# EAGLE design toastershield (EAGLE 7.5.0)
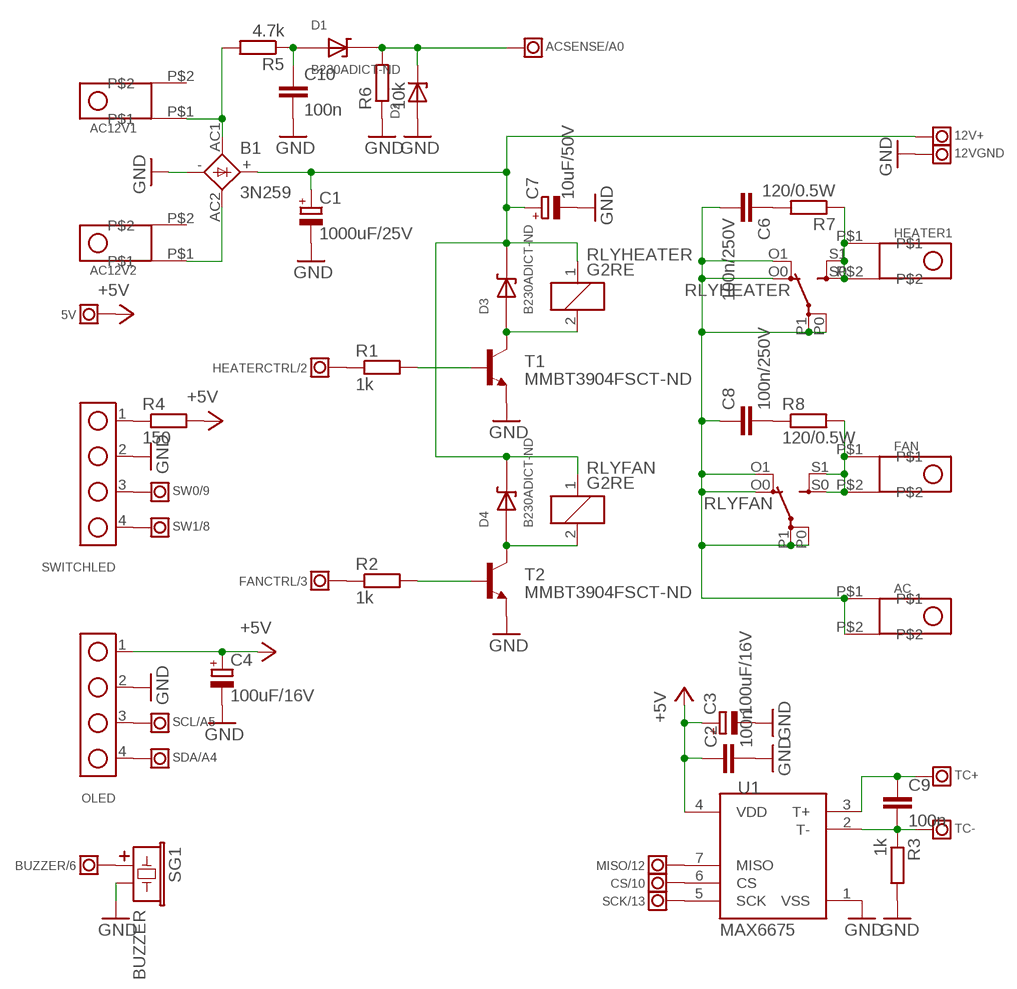
[diagram p0: schematic, sheet 1]

## Parts
5V  PIN-HEADER  [PIN-HEADER-MALE]
12V+  PIN-HEADER  [PIN-HEADER-MALE]
12VGND  PIN-HEADER  [PIN-HEADER-MALE]
AC  QUICKCONNECT-TAB  [QUICKCONNECT-TAB-6.35X0.81]
AC12V1  QUICKCONNECT-TAB  [QUICKCONNECT-TAB-6.35X0.81]
AC12V2  QUICKCONNECT-TAB  [QUICKCONNECT-TAB-6.35X0.81]
ACSENSE/A0  PIN-HEADER  [PIN-HEADER-MALE]
B1  3N259  [KBPM]
BUZZER/6  PIN-HEADER  [PIN-HEADER-MALE]
C1  1000uF/25V  CPOL-EUE5-13  [E5-13]
C2  100n  C-EUC0603  [C0603]
C3  100uF/16V  CPOL-EUE2.5-7  [E2,5-7]
C4  100uF/16V  CPOL-EUE2.5-7  [E2,5-7]
C6  100n/250V  C-EUC1210  [C1210]
C7  10uF/50V  CPOL-EUE2.5-5  [E2,5-5]
C8  100n/250V  C-EUC1210  [C1210]
C9  100n  C-EUC0603  [C0603]
C10  100n  C-EUC0603  [C0603]
CS/10  PIN-HEADER  [PIN-HEADER-MALE]
D1  B230ADICT-ND  [SMA/SMB]
D2  MA8051CT  [SOD323-W]
D3  B230ADICT-ND  [SMA/SMB]
D4  B230ADICT-ND  [SMA/SMB]
FAN  QUICKCONNECT-TAB  [QUICKCONNECT-TAB-6.35X0.81]
FANCTRL/3  PIN-HEADER  [PIN-HEADER-MALE]
HEATER1  QUICKCONNECT-TAB  [QUICKCONNECT-TAB-6.35X0.81]
HEATERCTRL/2  PIN-HEADER  [PIN-HEADER-MALE]
MISO/12  PIN-HEADER  [PIN-HEADER-MALE]
OLED  4-PIN-WAFER-CONN  [WAFER_MALE_4PIN]
R1  1k  R-EU_R0603  [R0603]
R2  1k  R-EU_R0603  [R0603]
R3  1k  R-EU_R0603  [R0603]
R4  150  R-EU_R0603  [R0603]
R5  4.7k  R-EU_R0603  [R0603]
R6  10k  R-EU_R0603  [R0603]
R7  120/0.5W  R-EU_R1210  [R1210]
R8  120/0.5W  R-EU_R1210  [R1210]
RLYFAN  G2RE  [G2RE]
RLYHEATER  G2RE  [G2RE]
SCK/13  PIN-HEADER  [PIN-HEADER-MALE]
SCL/A5  PIN-HEADER  [PIN-HEADER-MALE]
SDA/A4  PIN-HEADER  [PIN-HEADER-MALE]
SG1  BUZZER  [BUZZER-12X7.5]
SW0/9  PIN-HEADER  [PIN-HEADER-MALE]
SW1/8  PIN-HEADER  [PIN-HEADER-MALE]
SWITCHLED  4-PIN-WAFER-CONN  [WAFER_MALE_4PIN]
T1  MMBT3904FSCT-ND  [SOT-23]
T2  MMBT3904FSCT-ND  [SOT-23]
TC+  PIN-HEADER  [PIN-HEADER-MALE]
TC-  PIN-HEADER  [PIN-HEADER-MALE]
U1  MAX6675  [SO08-MAX6675]

## Nets
12VDC: 12V+.P$1 B1.+ C1.+ C7.+ D3.1(CAT) D4.1(CAT) RLYFAN.1 RLYHEATER.1
+5V: 5V.P$1 C2.1 C3.+ C4.+ OLED.1 R4.2 U1.4(VDD)
AC: AC.P$1 AC.P$2 C6.2 C8.1 RLYFAN.O0(2:O) RLYFAN.O1(2:O) RLYFAN.P0(2:P) RLYFAN.P1(2:P) RLYHEATER.O0(2:O) RLYHEATER.O1(2:O) RLYHEATER.P0(2:P) RLYHEATER.P1(2:P)
AC12V0: AC12V1.P$1 B1.AC1 R5.2
AC12V1: AC12V2.P$1 B1.AC2
BUZZER: BUZZER/6.P$1 SG1.+
FAN: FAN.P$1 FAN.P$2 R8.2 RLYFAN.S0(2:S) RLYFAN.S1(2:S)
GND: 12VGND.P$1 B1.- C1.- C2.2 C3.- C4.- C7.- C10.2 D2.A(AN) OLED.2 R3.2 R6.1 SG1.- SWITCHLED.2 T1.2(E) T2.2(E) U1.1(VSS)
HEATER: HEATER1.P$1 HEATER1.P$2 R7.1 RLYHEATER.S0(2:S) RLYHEATER.S1(2:S)
LED+: R4.1 SWITCHLED.1
N$1: C9.1 TC+.P$1 U1.3(T+)
N$2: FANCTRL/3.P$1 R2.1
N$4: HEATERCTRL/2.P$1 R1.1
N$5: D3.2(AN) RLYHEATER.2 T1.3(C)
N$6: D4.2(AN) RLYFAN.2 T2.3(C)
N$8: R1.2 T1.1(B)
N$9: R2.2 T2.1(B)
N$10: MISO/12.P$1 U1.7(MISO)
N$13: C9.2 R3.1 TC-.P$1 U1.2(T-)
N$14: CS/10.P$1 U1.6(CS)
N$16: SCK/13.P$1 U1.5(SCK)
N$17: SW0/9.P$1 SWITCHLED.3
N$18: SW1/8.P$1 SWITCHLED.4
N$19: OLED.3 SCL/A5.P$1
N$20: OLED.4 SDA/A4.P$1
N$22: C10.1 D1.2(AN) R5.1
N$23: ACSENSE/A0.P$1 D1.1(CAT) D2.C(CAT) R6.2
N$24: C8.2 R8.1
N$26: C6.1 R7.2
Unconnected: AC12V1.P$2 AC12V2.P$2

## Library data of the parts
5V 12V+ 12VGND ACSENSE/A0 BUZZER/6 CS/10 FANCTRL/3 HEATERCTRL/2 MISO/12 SCK/13 SCL/A5 SDA/A4 SW0/9 SW1/8 TC+ TC- = mrrcomps:PIN-HEADER
AC AC12V1 AC12V2 FAN HEATER1 = Wafer-Connectors:QUICKCONNECT-TAB
B1 = BAV70:3N259
C1 C3 C4 C7 = rcl:CPOL-EU: POLARIZED CAPACITOR, European symbol
C2 C6 C8-C10 = rcl:C-EU: CAPACITOR, European symbol
D1 D3 D4 = mrrcomps:B230ADICT-ND
D2 = mrrcomps:MA8051CT
OLED SWITCHLED = Wafer-Connectors:4-PIN-WAFER-CONN
R1-R8 = rcl:R-EU_: RESISTOR, European symbol
RLYFAN RLYHEATER = relay:G2RE: RELAY 1 x switch, high current, Omron
SG1 = SparkFun-Electromechanical:BUZZER: Buzzer 12mm Spark Fun Electronics SKU : Comp-Buzzer
T1 T2 = GuShH:MMBT3904
U1 = SparkFun-AnalogIC:MAX6675: K-type thermocouple ADC, SPI output

## Net classes
0 default: width 0.203 mm, drill 0.559 mm, clearance 0.203 mm
2 gnd: width 0.203 mm, drill 0.559 mm, clearance 0.203 mm

## Board
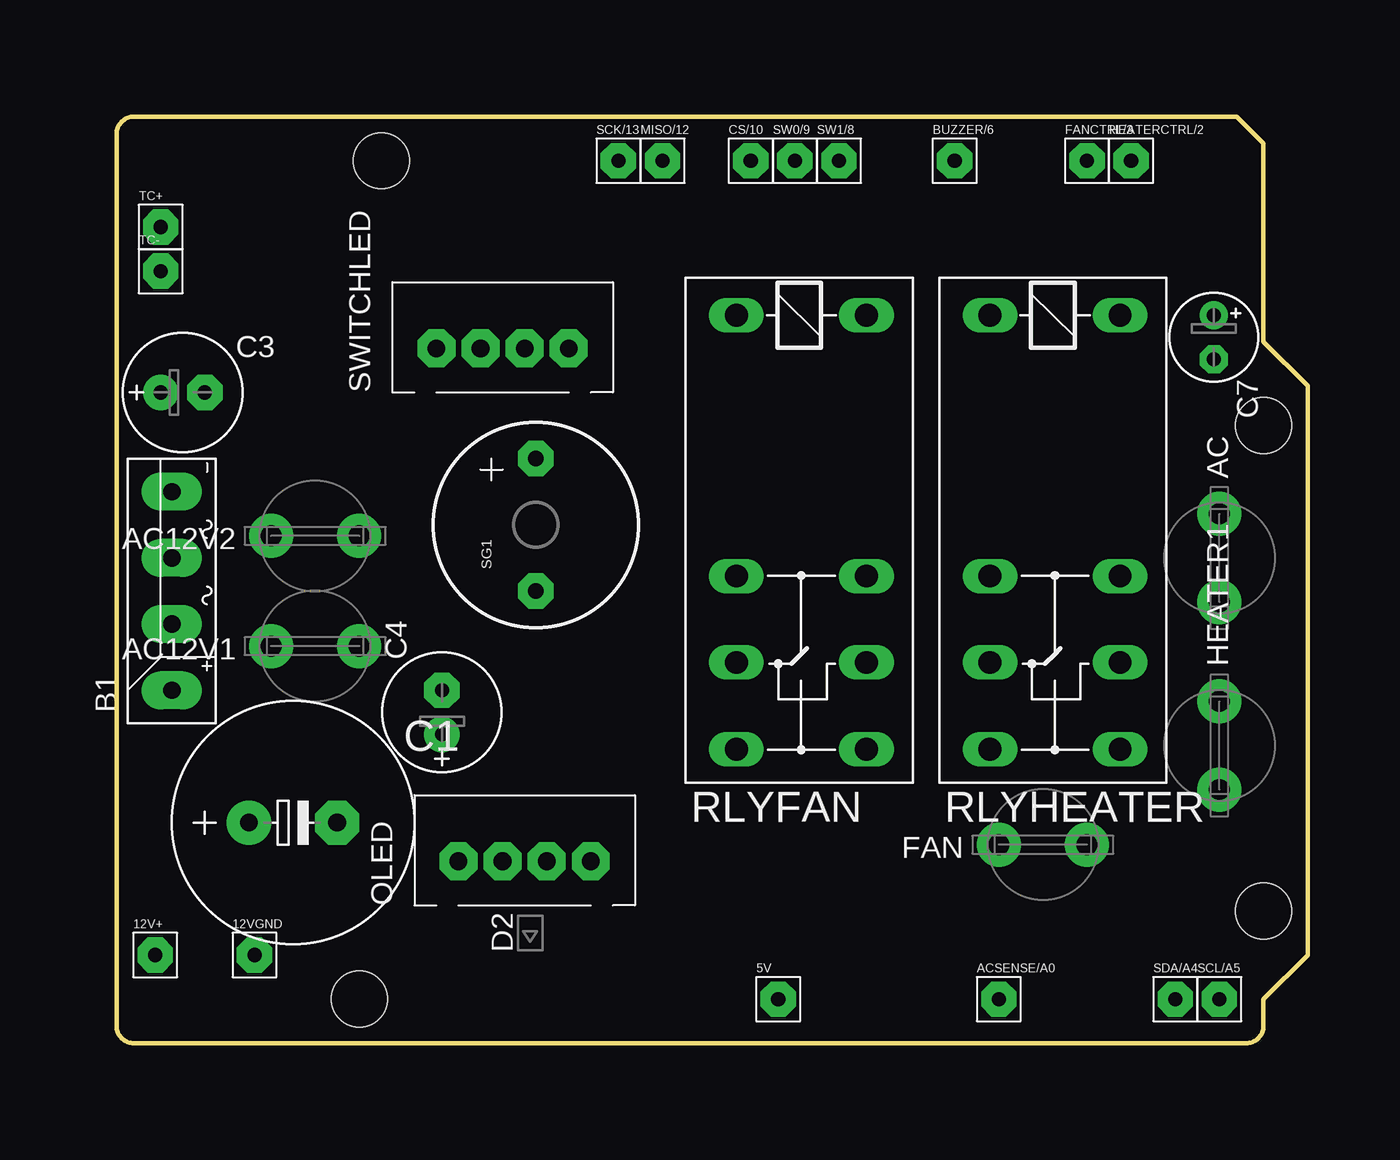
[diagram p1: board, top side]
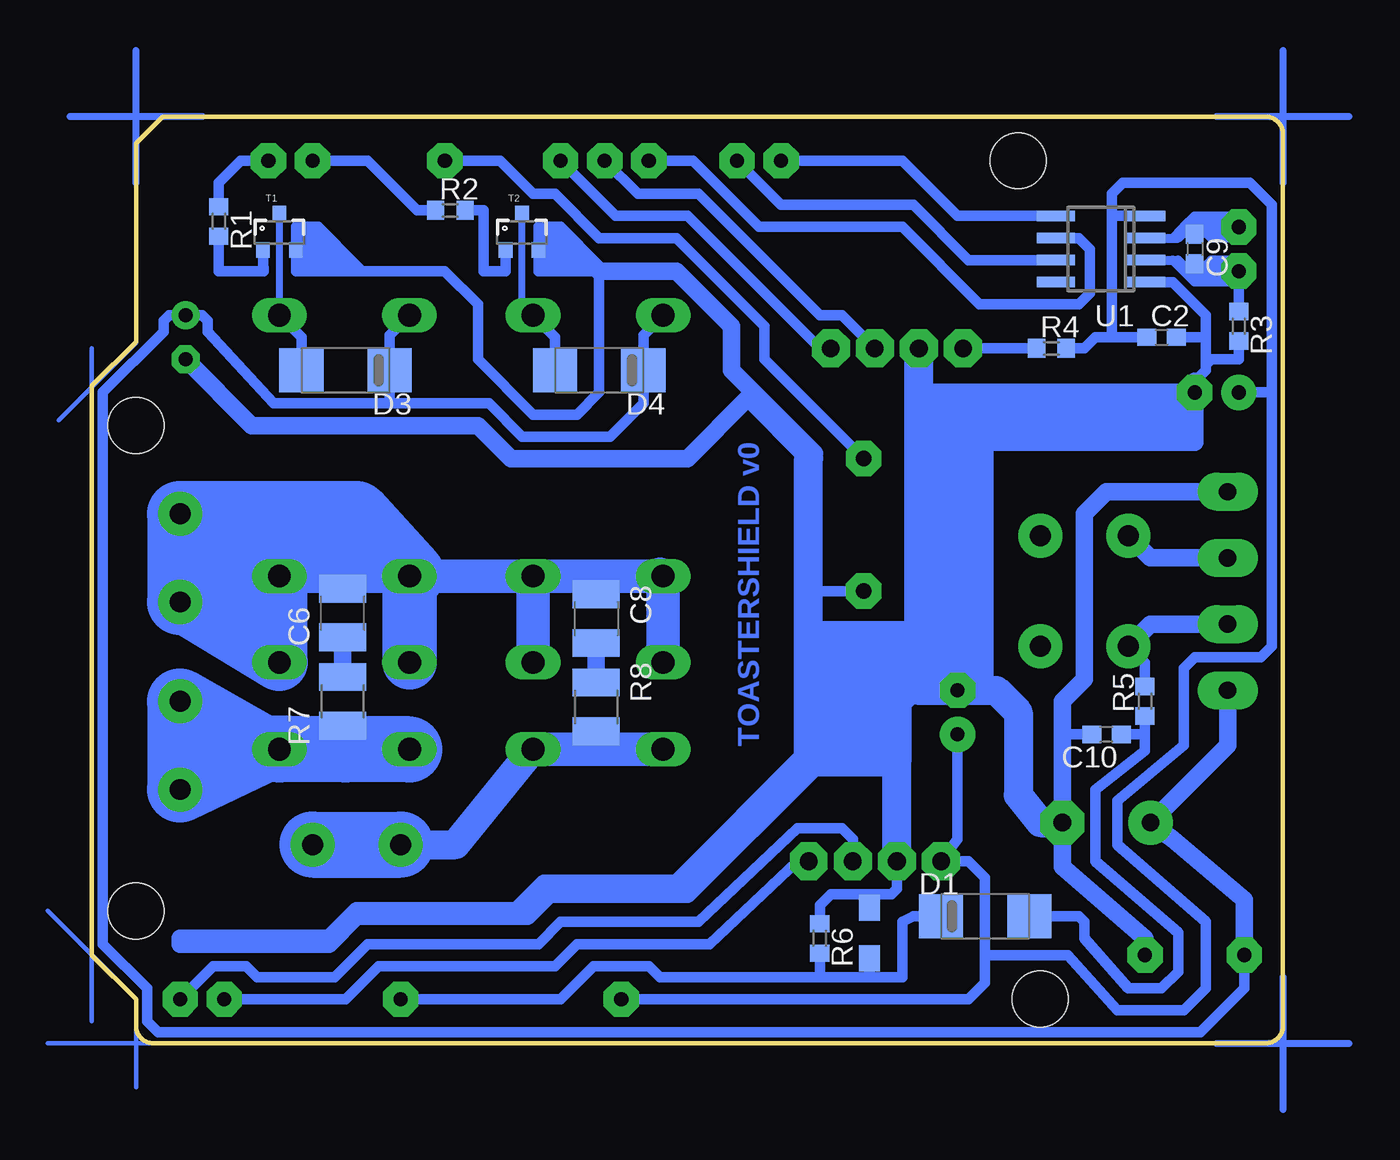
[diagram p2: board, bottom side, seen from below]

Size 68.58 x 53.34 mm. Coordinates in mm from the lower left corner, seen from the top.
Outline: 64.52,53.34 66.04,51.82 66.04,40.39 68.58,37.85 68.58,5.08 66.04,2.54 66.04,1 arc-90 65.04,0 1,0 arc-90 0,1 0,52.34 arc-90 1,53.34 64.52,53.34
Copper layers (1*16): Top 0.035mm / dielectric 1.5mm / Bottom 0.035mm
Design rules "ArduinoUno *": minimum track width 12mil, minimum drill 32mil, track to track 12mil, track to pad 12mil, pad to pad 12mil, via to via 12mil, smd to smd 12mil, copper to edge 32mil, drill to drill 16mil, minimum pad ring 10mil, minimum via ring 10mil, stop-mask expansion 2mil, vias tented up to drill 30mil, thermal gap 10mil
Holes 3.2 mm at 15.24,50.8 66.04,7.62 66.04,35.56 13.97,2.54

### Footprints (pad centres in the part's own frame; a part is rotated, then mirrored left to right if it is on the bottom)
PIN-HEADER-MALE = drill 0.813 pad 2.032 octagon: P$1 0,0
QUICKCONNECT-TAB-6.35X0.81 = drill 1.2 pad 2.54: P$1 2.54,0; P$2 -2.54,0
KBPM = drill 1 pad 2.184 long: + -5.715,0; - 5.715,0; AC1 -1.905,0; AC2 1.905,0
E5-13 = drill 1.016 pad 2.54: + -2.54,0 | drill 1.016 pad 2.54 octagon: - 2.54,0
C0603 = smd 1.1 x 1: 1 -0.85,0; 2 0.85,0
E2,5-7 = drill 0.813 pad 2.032: + -1.27,0 | drill 0.813 pad 2.032 octagon: - 1.27,0
C1210 = smd 1.6 x 2.7: 1 -1.4,0; 2 1.4,0
E2,5-5 = drill 0.813 pad 1.6: + -1.27,0 | drill 0.813 pad 1.6 octagon: - 1.27,0
SMA/SMB = smd 2.54 x 2.54: 1 -2.54,0; 2 2.54,0
SOD323-W = smd 1.5 x 1.2 bottom: A 1.45,0; C -1.45,0
WAFER_MALE_4PIN = drill 1.016 pad 2.184 octagon: 1 -3.81,0; 2 -1.27,0; 3 1.27,0; 4 3.81,0
R0603 = smd 1 x 1.1: 1 -0.85,0; 2 0.85,0
R1210 = smd 1.6 x 2.7: 1 -1.4,0; 2 1.4,0
G2RE = drill 1.321 long: 1 -2.54,-3.683; 2 -2.54,3.81; O0 12.471,-3.683; O1 12.471,3.81; P0 17.45,-3.683; P1 17.45,3.81; S0 22.454,-3.683; S1 22.454,3.81
BUZZER-12X7.5 = drill 0.9 pad 2.032 octagon: + 3.81,0; - -3.81,0
SOT-23 = smd 0.8 x 0.9: 1 -0.95,-1; 2 0.95,-1; 3 0,1.1
SO08-MAX6675 = smd 0.6 x 2.2: 1 -1.905,-2.6; 2 -0.635,-2.6; 3 0.635,-2.6; 4 1.905,-2.6; 5 1.905,2.6; 6 0.635,2.6; 7 -0.635,2.6; 8 -1.905,2.6

### Placement (x,y rotation side)
5V  38.1,2.54 0 top
12V+  2.22,5.08 0 top
12VGND  7.94,5.08 0 top
AC  63.5,27.94 90 top
AC12V1  11.43,22.86 180 top
AC12V2  11.43,29.21 180 top
ACSENSE/A0  50.8,2.54 0 top
B1  3.17,26.04 90 top
BUZZER/6  48.26,50.8 0 top
C1  10.16,12.7 0 top
C2  6.99,40.64 0 bottom
C3  3.81,37.47 0 top
C4  18.73,19.05 90 top
C6  54.15,24.77 90 bottom
C7  63.18,40.64 270 top
C8  39.54,24.45 270 bottom
C9  5.08,45.72 270 bottom
C10  10.16,17.78 180 bottom
CS/10  36.51,50.8 0 top
D1  17.14,7.3 0 bottom
D2  23.81,6.35 90 top
D3  53.98,38.73 180 bottom
D4  39.37,38.73 180 bottom
FAN  53.34,11.43 180 top
FANCTRL/3  55.88,50.8 0 top
HEATER1  63.5,17.14 90 top
HEATERCTRL/2  58.42,50.8 0 top
MISO/12  31.43,50.8 0 top
OLED  23.5,10.48 0 top
R1  61.28,47.31 270 bottom
R2  47.94,47.94 0 bottom
R3  2.54,41.27 270 bottom
R4  13.34,40.01 0 bottom
R5  7.94,19.68 90 bottom
R6  26.67,6.03 270 bottom
R7  54.15,19.68 90 bottom
R8  39.54,19.37 270 bottom
RLYFAN  39.37,39.37 270 top
RLYHEATER  53.98,39.37 270 top
SCK/13  28.89,50.8 0 top
SCL/A5  63.5,2.54 0 top
SDA/A4  60.96,2.54 0 top
SG1  24.13,29.84 90 top
SW0/9  39.05,50.8 0 top
SW1/8  41.59,50.8 0 top
SWITCHLED  22.23,40.01 0 top
T1  57.78,46.67 0 bottom
T2  43.81,46.67 0 bottom
TC+  2.54,46.99 0 top
TC-  2.54,44.45 0 top
U1  10.48,45.72 90 bottom

### Tracks (layer width: path | path; a pad name or v marks a point on that pad's centre or on a via)
12VDC
  Bottom 0.61: 12V+.P$1 2.22,3.17 4.76,0.64 64.77,0.64 65.41,1.27 65.41,3.17 67.94,5.71 67.94,37.47 64.45,40.96 64.45,41.59 64.14,41.91 C7.+ 62.23,41.91 61.91,41.59 61.91,40.96 58.1,36.83 51.44,36.83 | 51.44,36.83 45.72,36.83 43.81,34.92 38.73,34.92 36.83,36.83 D4.1 36.83,40.77 RLYFAN.1 | 51.44,36.83 D3.1 51.44,40.77 RLYHEATER.1
  Bottom 1.016: 12V+.P$1 2.22,8.26 6.35,11.75 C1.+ 3.17,17.14 B1.+
+5V
  Bottom 0.61: 9.84,47.62 9.84,48.9 9.21,49.53 1.91,49.53 0.64,48.26 0.64,37.47 | 5V.P$1 18.1,2.54 17.14,3.49 17.14,5.08 | 0.64,37.47 0.64,22.86 1.27,22.23 5.08,22.23 5.71,21.59 5.71,17.14 9.53,13.97 9.53,11.43 4.45,6.99 4.45,3.17 5.71,1.91 9.53,1.91 12.38,5.08 17.14,5.08 | 17.14,5.08 17.14,9.53 18.1,10.48 OLED.1 18.73,11.75 C4.+ | 9.84,47.62 9.84,40.64 | R4.2 11.43,40.01 10.79,40.64 9.84,40.64 | C3.+ 0.64,37.47 | U1.4 9.84,47.62 | C2.1 9.84,40.64
AC
  Bottom 1.016: 39.37,26.9 C8.1 39.37,25.85 39.37,26.99 35.88,26.99 | C6.2 53.98,26.9 | 35.88,26.67 35.69,26.67
  Bottom 1.93: RLYFAN.O0 39.37,26.9 RLYFAN.O1 | RLYFAN.O1 RLYHEATER.O0 53.98,26.9 RLYHEATER.O1 | RLYFAN.P1 RLYFAN.O1 | 35.88,26.99 35.88,26.67 | 35.69,26.67 RLYFAN.P0
  Bottom 3.15: RLYHEATER.P0 RLYHEATER.O0
  Bottom 3.302: RLYHEATER.P1 AC.P$2
  Bottom 3.81: AC.P$1 AC.P$2 | RLYHEATER.O1 AC.P$1 | AC.P$1 53.34,30.48 50.16,26.99
AC12V0
  Bottom 0.61: AC12V1.P$1 7.94,21.91 R5.2
  Bottom 1.016: B1.AC1 7.62,24.13 AC12V1.P$1
AC12V1
  Bottom 1.016: B1.AC2 7.62,27.94 AC12V2.P$1
BUZZER
  Bottom 0.61: SG1.+ 29.84,39.37 29.84,41.27 34.92,46.35 39.37,46.35 41.91,48.9 43.18,48.9 45.09,50.8 BUZZER/6.P$1
FAN
  Bottom 1.016: R8.2 39.69,17.97 39.69,16.92
  Bottom 1.676: FAN.P$1 47.62,11.43 RLYFAN.S1
  Bottom 1.93: RLYFAN.S1 39.69,16.92 RLYFAN.S0
  Bottom 3.81: FAN.P$2 FAN.P$1
GND
  Bottom 0.61: 56.83,45.72 56.83,46.99 55.56,46.99 53.34,44.77 | 39.37,44.45 39.37,37.47 40.64,36.2 43.18,36.2 46.35,39.37 46.35,42.55 48.26,44.45 53.02,44.45 | 27.3,26.04 SG1.- | 5.71,40.64 C2.2 4.45,40.64 | R3.2 2.54,39.37 4.13,39.37 4.45,39.05 | 4.45,39.05 4.45,40.64 | U1.1 6.35,43.81 4.45,41.91 4.45,40.64 | 4.45,39.05 4.45,38.73 5.08,38.1 | 39.37,44.45 39.37,44.77 41.59,46.99 42.86,46.99 42.86,45.09 42.55,44.77 40.01,44.77 42.23,46.99 42.55,46.99 42.55,46.35 | 23.95,8.57 D2.A | R6.1 26.67,7.94 26.04,8.57 23.95,8.57 | 23.95,8.57 22.54,8.57 22.23,8.89 OLED.2 | C10.2 12.7,17.78 | T2.2 42.87,44.45 42.86,44.45 39.37,44.45 | 42.55,46.35 42.55,45.09 42.23,45.09 | 42.23,45.09 40.96,45.09 42.23,46.35 42.55,46.35 | 42.55,46.35 41.91,45.72 41.91,45.4 | 42.23,45.09 42.23,45.72 | 53.02,44.45 56.83,44.45 T1.2 | 53.02,44.45 53.34,44.77 | 53.34,44.77 56.52,44.77 56.52,46.99 55.88,46.99 53.98,45.09 56.2,45.09 56.2,46.67 54.93,45.4 55.88,45.4 55.88,46.04
  Bottom 1.016: 39.37,44.45 34.92,44.45 31.75,41.27 31.75,38.73 26.99,33.97 27.3,33.66 30.8,37.15 34.29,33.66 44.45,33.66 46.35,35.56 59.37,35.56 C7.- | 12VGND.P$1 7.94,6.03 12.7,10.16 C1.- 12.7,17.78 12.7,19.68 11.43,20.95 11.43,30.48 10.16,31.75 B1.- | 5.08,38.1 C3.- | C3.- 20.95,37.47 | C3.- 5.08,34.61 17.14,34.61 | 17.14,34.61 20.95,34.61 | 17.14,34.61 17.14,20.32 | 22.23,15.88 26.99,15.88 34.29,8.57 42.23,8.57 43.5,7.3 53.34,7.3 54.93,5.71 63.5,5.71 63.5,6.03 54.93,6.03 53.34,7.62 44.13,7.62 42.55,9.21 34.92,9.21 27.3,16.83
  Bottom 1.676: OLED.2 22.23,15.88 22.23,16.19 | 27.3,33.66 27.3,26.04 27.3,16.83 27.3,16.19 22.23,16.19 | 20.95,20.32 C4.- 17.14,20.32 16.51,20.32 15.24,19.05 15.24,14.29 13.97,12.7 C1.- | 20.95,20.32 20.95,34.61 20.95,37.47 SWITCHLED.2 | 20.95,20.32 21.59,20.32 22.23,19.68 22.23,16.19
HEATER
  Bottom 1.016: R7.1 53.98,16.92
  Bottom 3.81: RLYHEATER.S0 53.98,16.92 RLYHEATER.S1 58.62,16.93 HEATER1.P$1 HEATER1.P$2 58.54,16.95 57.1,16.95
LED+
  Bottom 0.61: R4.1 SWITCHLED.1
N$1
  Bottom 0.508: U1.3 6.35,46.35 | 6.35,46.35 6.03,46.67 | 6.03,46.67 5.71,46.67 6.03,46.35 6.35,46.35 | 6.03,46.67 5.4,47.31 | 5.4,47.31 2.86,47.31 | 2.54,46.35 4.13,46.35 4.45,46.67 | 5.4,47.31 5.08,47.62 2.54,47.62
  Bottom 0.61: 5.71,46.67 5.08,46.67 | 5.08,46.35 C9.1 | 5.08,46.67 C9.1 | C9.1 4.76,46.57 4.76,46.67 | 4.76,46.67 5.08,46.67 | 4.76,46.67 4.45,46.67 2.86,46.67 TC+.P$1 | 2.86,47.31 TC+.P$1 | TC+.P$1 5.08,46.99 | TC+.P$1 2.54,46.35
N$2
  Bottom 0.61: R2.1 49.85,47.94 52.7,50.8 FANCTRL/3.P$1
N$3  (via drill 0.6)
  other vias: 15.24,50.8
N$4
  Bottom 0.61: R1.1 61.28,49.53 60.01,50.8 HEATERCTRL/2.P$1
N$5
  Bottom 0.406: T1.3 RLYHEATER.2
  Bottom 0.61: D3.2 56.52,40.64 RLYHEATER.2
N$6
  Bottom 0.406: 43.81,42.55 T2.3
  Bottom 0.61: D4.2 41.91,40.64 RLYFAN.2 43.81,42.55
N$7  (via drill 0.6)
  other vias: 13.97,2.54
N$8
  Bottom 0.61: T1.1 58.69,44.45 61.28,44.45 R1.2
N$9
  Bottom 0.61: T2.1 44.77,44.77 44.77,44.45 46.04,44.45 46.04,47.94 R2.2
N$10
  Bottom 0.61: U1.7 18.1,45.09 21.27,48.26 28.89,48.26 MISO/12.P$1
N$11
  Bottom 1.93: 35.69,26.89 35.69,21.91
N$12  (via drill 0.6)
  other vias: 66.04,7.62
N$13
  Bottom 0.508: U1.2 6.35,45.09 | 6.35,45.09 6.03,44.77 | 6.03,44.77 5.71,44.77 | 5.71,44.77 5.08,44.77 4.45,44.77 4.13,45.09 2.54,45.09 | 6.03,44.77 5.71,44.45 5.4,44.13 | 5.4,44.13 2.86,44.13 | TC-.P$1 4.76,44.45 | 6.35,45.09 6.03,45.09 5.71,44.77 | 2.54,43.81 5.08,43.81 5.4,44.13
  Bottom 0.61: R3.1 2.54,43.81 TC-.P$1 | C9.2 5.08,44.77 | 4.45,44.77 2.86,44.77 TC-.P$1 | 2.86,44.13 TC-.P$1 | TC-.P$1 2.54,45.09
N$14
  Bottom 0.61: U1.6 11.75,46.35 11.11,45.72 11.11,43.18 11.75,42.55 17.46,42.55 21.91,46.99 30.16,46.99 33.97,50.8 CS/10.P$1
N$16
  Bottom 0.61: U1.5 18.73,47.62 21.91,50.8 SCK/13.P$1
N$17
  Bottom 0.61: SW0/9.P$1 37.15,48.9 33.66,48.9 26.67,41.91 25.4,41.91 SWITCHLED.3
N$18
  Bottom 0.61: SWITCHLED.4 26.67,40.01 34.29,47.62 38.42,47.62 SW1/8.P$1
N$19
  Bottom 0.61: OLED.3 24.77,11.75 25.4,12.38 27.94,12.38 33.66,6.99 41.59,6.99 42.86,5.71 52.7,5.71 54.61,3.81 59.05,3.81 59.69,4.45 61.59,4.45 SCL/A5.P$1
N$20
  Bottom 0.61: SDA/A4.P$1 53.98,2.54 52.07,4.45 41.91,4.45 40.64,5.71 33.02,5.71 27.94,10.48 OLED.4
N$21  (via drill 0.6)
  other vias: 66.04,35.56
N$22
  Bottom 0.61: R5.1 7.94,17.78 | C10.1 7.94,17.78 | 7.94,17.78 7.94,16.83 10.79,14.61 10.79,10.48 6.03,6.35 6.03,4.13 6.99,3.17 8.89,3.17 11.43,6.03 11.43,6.99 11.75,7.3 D1.2
N$23
  Bottom 0.61: D2.C 23.81,3.81 | 23.81,3.81 26.67,3.81 | 26.67,3.81 35.88,3.81 36.51,4.45 39.69,4.45 41.59,2.54 ACSENSE/A0.P$1 | R6.2 26.67,3.81 | D1.1 21.27,7.3 21.91,6.99 21.91,3.81 23.81,3.81
N$24
  Bottom 1.016: R8.1 C8.2
N$25
  Bottom 0.254: 66.04,43.81 66.04,40.32
N$26
  Bottom 1.016: R7.2 C6.1
N$27
  Bottom 0.406: -3.81,53.34 3.81,53.34
N$28
  Bottom 0.406: 0,57.15 0,49.53
N$29
  Bottom 0.406: 62.23,53.34 69.85,53.34
N$30
  Bottom 0.406: 66.04,49.53 66.04,57.15
N$31
  Bottom 0.406: 3.81,0 -3.81,0
N$32
  Bottom 0.406: 0,3.81 0,-3.81
N$33
  Bottom 0.254: 62.23,0 71.12,0
N$34
  Bottom 0.254: 68.58,8.89 68.58,1.27
N$35
  Bottom 0.254: 70.48,35.88 66.04,40.32
N$36
  Bottom 0.254: 68.58,40.01 68.58,34.92
N$37
  Bottom 0.254: 66.67,3.17 71.12,7.62
N$38
  Bottom 0.254: 66.04,2.54 66.04,-2.54
(copper drawn outside any net)
  shapes: Bottom area x9

### Text on the board
Bottom: TOASTERSHIELD v0